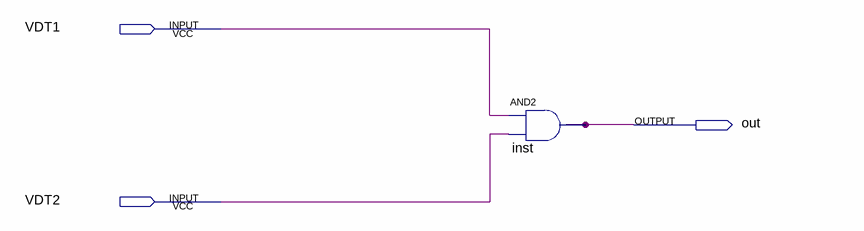
[diagram p0: schematic sheet]
// Quartus schematic assignment1.bdf as structural Verilog: 1 symbols, 3 pins
module assignment1 (
  input  VDT1,
  input  VDT2,
  output out
);

  and inst (out, VDT1, VDT2);
endmodule
